# EAGLE design clock (EAGLE 9.0.0)
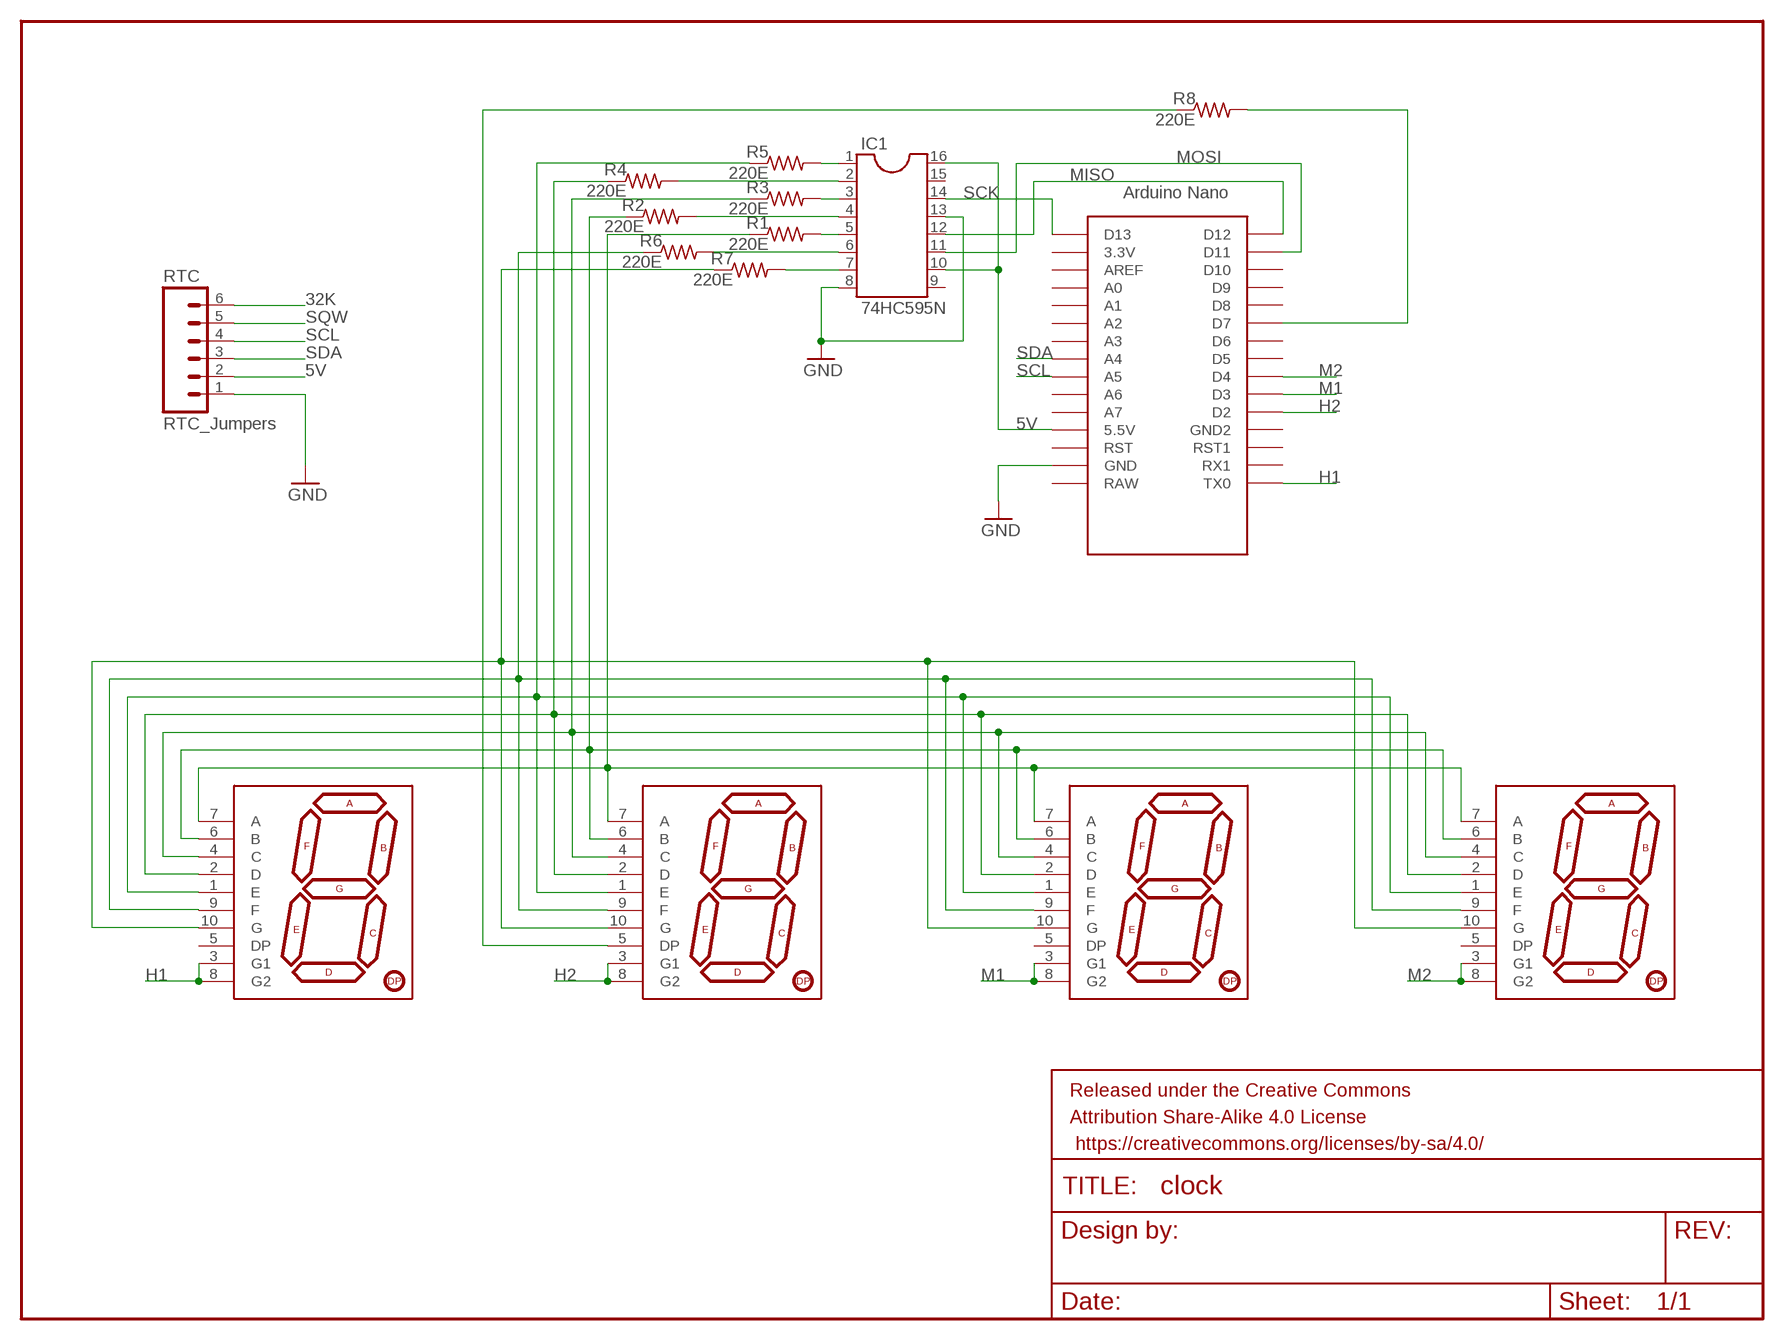
[diagram p0: schematic, sheet 1]

## Parts
FRAME1  FRAME-LETTERNO_PACKAGE  [DUMMY]
IC1  74HC595N  DIL16  [DIL16]
R1  220E  R-US_0309/10  [0309/10]
R2  220E  R-US_0309/10  [0309/10]
R3  220E  R-US_0309/10  [0309/10]
R4  220E  R-US_0309/10  [0309/10]
R5  220E  R-US_0309/10  [0309/10]
R6  220E  R-US_0309/10  [0309/10]
R7  220E  R-US_0309/10  [0309/10]
R8  220E  R-US_0309/10  [0309/10]
RTC  RTC_Jumpers  M06SIP  [1X06]
U$1  7-SEGMENT-1INCH-DIGIT-RED  [7-SEGMENT-1"PTH]
U$2  7-SEGMENT-1INCH-DIGIT-RED  [7-SEGMENT-1"PTH]
U$3  7-SEGMENT-1INCH-DIGIT-RED  [7-SEGMENT-1"PTH]
U$4  7-SEGMENT-1INCH-DIGIT-RED  [7-SEGMENT-1"PTH]
U$5  NANO  [NANO]

## Nets
5V: IC1.10 IC1.16 RTC.2 U$5.5V(5.5V)
32K: RTC.6
A: R1.1 U$1.7(A) U$2.7(A) U$3.7(A) U$4.7(A)
B: R2.1 U$1.6(B) U$2.6(B) U$3.6(B) U$4.6(B)
C: R3.1 U$1.4(C) U$2.4(C) U$3.4(C) U$4.4(C)
D: R4.1 U$1.2(D) U$2.2(D) U$3.2(D) U$4.2(D)
D7: R8.2 U$5.D7
DP: R8.1 U$2.5(DP)
E: R5.1 U$1.1(E) U$2.1(E) U$3.1(E) U$4.1(E)
F: R6.1 U$1.9(F) U$2.9(F) U$3.9(F) U$4.9(F)
G: R7.1 U$1.10(G) U$2.10(G) U$3.10(G) U$4.10(G)
GND: IC1.8 IC1.13 RTC.1 U$5.GND
H1: U$1.3(G1) U$1.8(G2) U$5.TX0
H2: U$2.3(G1) U$2.8(G2) U$5.D2
M1: U$3.3(G1) U$3.8(G2) U$5.D3
M2: U$4.3(G1) U$4.8(G2) U$5.D4
MISO: IC1.12 U$5.D12
MOSI: IC1.11 U$5.D11
Q1: IC1.1 R5.2
Q2: IC1.2 R4.2
Q3: IC1.3 R3.2
Q4: IC1.4 R2.2
Q5: IC1.5 R1.2
Q6: IC1.6 R6.2
Q7: IC1.7 R7.2
SCK: IC1.14 U$5.D13
SCL: RTC.4 U$5.A5
SDA: RTC.3 U$5.A4
SQW: RTC.5
Unconnected: IC1.9 IC1.15 U$1.5(DP) U$3.5(DP) U$4.5(DP) U$5.3.3V U$5.A0 U$5.A1 U$5.A2 U$5.A3 U$5.A6 U$5.A7 U$5.AREF U$5.D5 U$5.D6 U$5.D8 U$5.D9 U$5.D10 U$5.GND1(GND2) U$5.ICSP1 U$5.ICSP2 U$5.ICSP3 U$5.ICSP4 U$5.ICSP5 U$5.ICSP6 U$5.RAW U$5.RST U$5.RST1 U$5.RX1

## Library data of the parts
FRAME1 = SparkFun-Aesthetics:FRAME-LETTER: Schematic Frame - Letter Standard 8.5x11 US Letter frame; DESIGNER: Nobody; VERSION: v01
IC1 = ic-package:DIL16: Dual In Line / Socket
R1-R8 = rcl:R-US_: RESISTOR, American symbol; SPICEPREFIX: R
RTC = SparkFun-Connectors:M06: Header 6 Standard 6-pin 0.1" header. Use with straight break away headers (SKU : PRT-00116), right angle break away headers (PRT-00553), swiss pins (PRT-00743), machine pins (PRT-00117), and female headers (PRT-00115). Molex polarized connector foot print use with SKU : PRT-08094 with associated crimp pins and housings. NOTES ON THE VARIANTS LOCK and LOCK_LONGPADS... This footprint was designed to help hold the alignment of a through-hole component (i.e. 6-pin header) while soldering it into place. You may notice that each hole has been shifted either up or down by 0.005 of an inch from it's more standard position (which is a perfectly straight line). This slight alteration caused the pins (the squares in the middle) to touch the edges of the holes. Because they are alternating, it causes a "brace" to hold the component in place. 0.005 has proven to be the perfect amount of "off-center" position when using our standard breakaway headers. Although looks a little odd when you look at the bare footprint, once you have a header in there, the alteration is very hard to notice. Also, if you push a header all the way into place, it is covered up entirely on the bottom side. This idea of altering the position of holes to aid alignment will be further integrated into the Sparkfun Library for other footprints. It can help hold any component with 3 or more connection pins.
U$1-U$4 = Clock:7-SEGMENT-1INCH-DIGIT: 7-Segment Display, single digit, 1" Digit Height Digit = 25.4mmx13.8mm, Outer Cover = 34mmx23.5mm, Pin Distance(height) = 30.5mm, Pin Distance(Width) = 2.54mm
U$5 = Arduino-clone:NANO: Arduino Nano

## Board
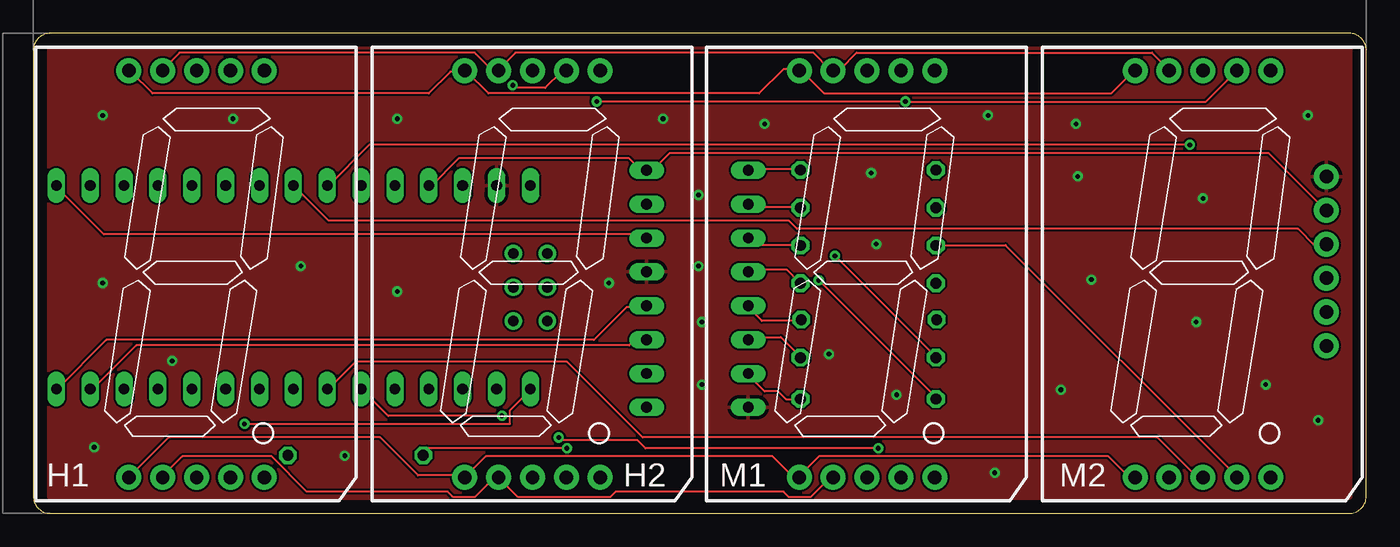
[diagram p1: board, top side]
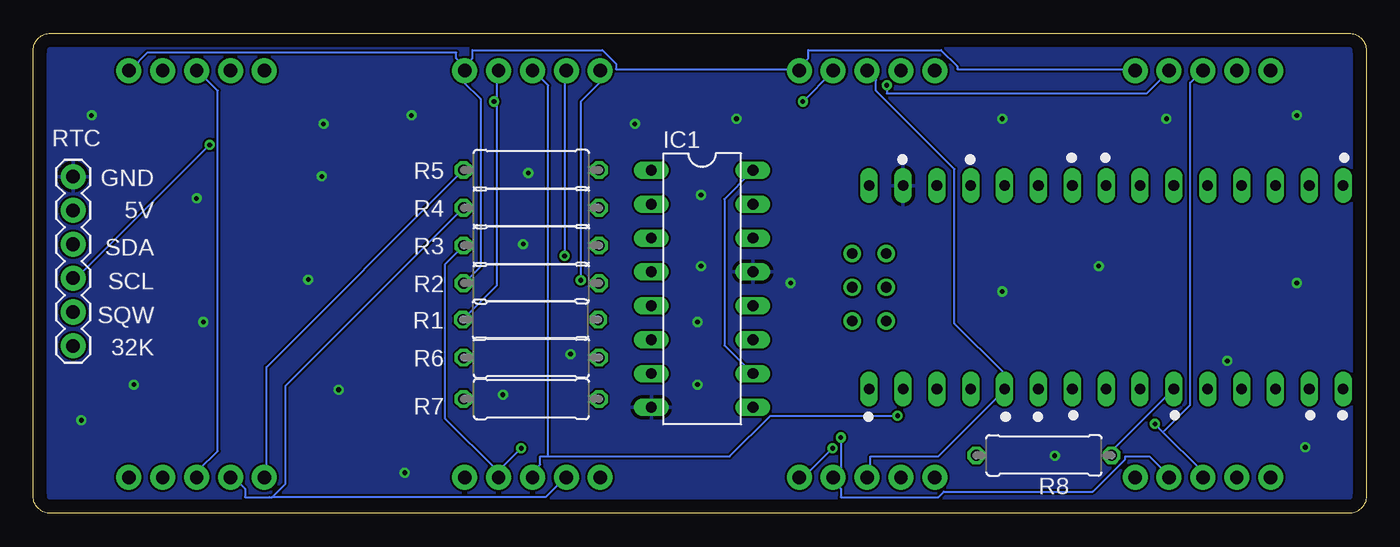
[diagram p2: board, bottom side, seen from below]

Size 100 x 36 mm. Coordinates in mm from the lower left corner, seen from the top.
Outline: 0,34.73 0,1.27 arc90 1.27,0 98.73,0 arc90 100,1.27 100,34.73 arc90 98.73,36 1.27,36 arc90 0,34.73
Copper layers (1*16): Top 0.035mm / dielectric 1.5mm / Bottom 0.035mm
Design rules "default": minimum track width 6mil, minimum drill 0.35mm, track to track 6mil, track to pad 6mil, pad to pad 6mil, via to via 6mil, smd to smd 6mil, copper to edge 40mil, drill to drill 6mil, minimum pad ring 10mil, minimum via ring 8mil, stop-mask expansion 4mil, vias tented up to drill 0mil, thermal gap 10mil

### Footprints (pad centres in the part's own frame; a part is rotated, then mirrored left to right if it is on the bottom)
DIL16 = drill 0.813 long: 1 -8.89,-3.81; 2 -6.35,-3.81; 3 -3.81,-3.81; 4 -1.27,-3.81; 5 1.27,-3.81; 6 3.81,-3.81; 7 6.35,-3.81; 8 8.89,-3.81; 9 8.89,3.81; 10 6.35,3.81; 11 3.81,3.81; 12 1.27,3.81; 13 -1.27,3.81; 14 -3.81,3.81; 15 -6.35,3.81; 16 -8.89,3.81
0309/10 = drill 0.813 octagon: 1 -5.08,0; 2 5.08,0
1X06 = drill 1.016 pad 1.88: 1 0,0; 2 2.54,0; 3 5.08,0; 4 7.62,0; 5 10.16,0; 6 12.7,0
7-SEGMENT-1"PTH = drill 1 pad 1.88: 1 -5.08,-20.5; 2 -2.54,-20.5; 3 0,-20.5; 4 2.54,-20.5; 5 5.08,-20.5; 6 5.08,10; 7 2.54,10; 8 0,10; 9 -2.54,10; 10 -5.08,10
NANO = drill 0.8 long: 3.3V -10.16,24.13; 5V -10.16,-1.27; A0 -10.16,19.05; A1 -10.16,16.51; A2 -10.16,13.97; A3 -10.16,11.43; A4 -10.16,8.89; A5 -10.16,6.35; A6 -10.16,3.81; A7 -10.16,1.27; AREF -10.16,21.59; D2 5.08,1.27; D3 5.08,3.81; D4 5.08,6.35; D5 5.08,8.89; D6 5.08,11.43; D7 5.08,13.97; D8 5.08,16.51; D9 5.08,19.05; D10 5.08,21.59; D11 5.08,24.13; D12 5.08,26.67; D13 -10.16,26.67; GND -10.16,-6.35; GND1 5.08,-1.27; RAW -10.16,-8.89; RST -10.16,-3.81; RST1 5.08,-3.81; RX1 5.08,-6.35; TX0 5.08,-8.89 | drill 0.8: ICSP1 -5.08,-10.16; ICSP2 -5.08,-7.62; ICSP3 -2.54,-10.16; ICSP4 -2.54,-7.62; ICSP5 0,-10.16; ICSP6 0,-7.62

### Placement (x,y rotation side)
FRAME1  -5.33,-6.73 0 top  (outside the outline)
IC1  49.83,16.84 270 bottom
R1  62.7,14.53 0 bottom
R2  62.64,17.26 0 bottom
R3  62.64,20.09 0 bottom
R4  62.64,22.92 0 bottom
R5  62.64,25.75 0 bottom
R6  62.64,11.68 0 bottom
R7  62.64,8.58 0 bottom
R8  24.18,4.35 0 bottom
RTC  97.02,25.26 270 bottom
U$1  12.25,23.2 0 top
U$2  37.45,23.2 0 top
U$3  62.55,23.2 0 top
U$4  87.75,23.2 0 top
U$5  28.4,14.42 270 bottom

### Tracks (layer width: path | path; a pad name or v marks a point on that pad's centre or on a via)
5V
  Top 0.152: U$5.5V 29.87,24.59 31.9,26.62 44.7,26.62 45.52,25.81 45.92,25.81 IC1.16 46.13,25.81 46.53,25.81 47.75,27.03 92.66,27.03 96.93,22.76 RTC.2
  Bottom 0.152: IC1.10 46.13,10.57 48.16,12.6 48.16,23.57 46.13,25.6 IC1.16
A  (via drill 0.35)
  Top 0.152: v35.97,32.11 36.17,31.9 38.41,31.9 39.62,33.12 39.83,33.12 U$2.7 | U$4.7 90.22,33.12 87.99,30.89 v65.43,30.89 v42.27,30.89
  Bottom 0.152: v35.97,32.11 35.97,31.5 16.46,31.5 14.83,33.12 U$1.7 | 65.23,30.89 65.23,33.12 U$3.7 | 65.23,30.89 65.23,17.07 67.67,14.63 R1.1 | 65.23,30.89 v65.43,30.89 | v42.27,30.89 40.03,33.12 U$2.7
B
  Bottom 0.152: U$1.6 17.48,33.33 30.68,33.33 30.68,33.53 31.9,34.75 41.86,34.75 41.86,34.14 42.47,33.53 42.47,33.33 U$2.6 42.67,33.33 56.29,33.33 56.29,33.73 57.3,34.75 67.06,34.75 67.06,34.14 67.67,33.53 | R2.1 67.67,17.27 66.45,18.49 66.45,31.09 67.67,32.31 67.67,33.12 U$3.6 | 67.67,33.53 68.28,34.14 68.28,34.54 91.44,34.54 92.66,33.33 U$4.6 | 67.67,33.53 67.67,33.33 U$3.6 | 67.67,33.53 U$3.6
C  (via drill 0.35)
  Top 0.152: U$4.4 90.22,2.85 72.95,20.12 67.87,20.12 R3.1 | v39.42,5.69 39.62,5.49 45.31,5.49 45.92,4.88 v63.4,4.88
  Bottom 0.152: U$1.4 14.83,2.85 16.26,4.27 18.09,4.27 18.09,4.06 20.52,1.63 31.7,1.63 32.11,1.22 39.42,1.22 39.42,1.83 39.83,2.23 39.83,2.64 U$2.4 39.83,2.85 39.42,3.25 v39.42,5.69 | 65.23,3.05 65.23,2.85 U$3.4 65.23,3.05 | 65.23,3.05 65.23,3.25 69.09,7.11 69.09,18.69 67.87,19.91 R3.1 | 65.23,3.05 v63.4,4.88
D
  Top 0.152: U$1.2 9.75,2.85 11.18,4.27 17.88,4.27 20.52,1.63 31.09,1.63 31.5,1.22 33.12,1.22 34.54,2.64 34.75,2.64 U$2.2 34.95,2.64 36.37,1.22 43.28,1.22 43.69,1.63 56.29,1.63 56.69,1.22 58.32,1.22 59.74,2.64 59.94,2.64 U$3.2
  Bottom 0.152: 82.09,1.22 81.08,2.23 81.08,9.55 67.87,22.76 R4.1 | 82.09,1.22 82.3,1.22 84.12,1.22 84.12,1.83 85.14,2.85 U$4.2 | U$3.2 60.15,2.64 61.57,1.22 82.09,1.22
D7
  Bottom 0.152: U$5.D7 14.63,9.14 18.9,4.88 18.9,4.47 R8.2
DP  (via drill 0.35)
  Top 0.152: v40.03,4.88 29.67,4.88 29.26,4.47 R8.1
  Bottom 0.152: v40.03,4.88 42.06,2.85 42.47,2.85 U$2.5
E
  Top 0.152: U$1.1 7.32,2.85 10.16,5.69 26.01,5.69 28.85,2.85 32.31,2.85 U$2.1 32.51,2.85 33.93,4.27 55.47,4.27 56.9,2.85 57.3,2.85 U$3.1 57.51,2.85 58.93,4.27 80.67,4.27 82.09,2.85 82.5,2.85 U$4.1
  Bottom 0.152: R5.1 67.87,25.6 82.5,10.97 82.5,2.85 U$4.1
F  (via drill 0.35)
  Top 0.152: U$1.9 9.75,33.33 10.97,34.54 33.12,34.54 34.34,33.33 34.75,33.33 U$2.9 34.95,33.33 36.17,34.54 58.52,34.54 59.74,33.33 59.94,33.33 U$3.9 60.15,33.33 60.55,33.33 61.77,34.54 83.92,34.54 85.14,33.33 U$4.9 | v60.15,19.3 67.67,11.79 R6.1
  Bottom 0.152: v60.15,19.3 60.15,33.12 U$3.9
G  (via drill 0.35)
  Top 0.152: U$1.10 7.32,33.12 8.94,31.5 29.67,31.5 31.29,33.12 32.31,33.12 U$2.10 32.51,33.12 34.14,31.5 54.46,31.5 56.29,33.33 57.3,33.33 U$3.10 57.51,33.12 57.71,33.12 59.33,31.5 80.87,31.5 82.5,33.12 U$4.10 | v58.93,17.48 67.67,8.74 R7.1
  Bottom 0.152: v58.93,17.48 58.93,30.89 57.51,32.31 57.51,33.12 U$3.10
GND  (via drill 0.35)
  other vias: 5.21,29.84 14.99,29.59 27.3,29.59 27.3,16.64 20.07,18.54 5.21,17.27 4.57,4.95 43.18,17.27 49.91,23.88 49.91,18.54 50.16,14.35 50.16,9.65 78.36,25.27 71.63,29.84 54.86,29.21 79.38,17.53 92.46,9.65 95.63,29.84 96.39,6.99 23.37,4.32 87.25,14.35 87.76,23.62 77.09,9.27 72.14,3.05 78.23,29.21 10.41,11.43 47.24,29.59 62.87,25.53 63.25,20.19 59.69,11.94 64.77,8.89
  pour Bottom: -0.25,36.83 100.33,36.83 100.33,-1.27 -0.25,-1.27
  pour Top: -0.25,36.83 100.33,36.83 100.33,-1.27 -0.25,-1.27
H1  (via drill 0.35)
  Top 0.152: v15.85,6.71 35.76,6.71 35.76,7.72 37.19,9.14 U$5.TX0
  Bottom 0.152: 15.24,6.1 12.39,3.25 12.39,2.85 U$1.3 | 15.24,6.1 v15.85,6.71 | 15.24,6.1 13.21,8.13 13.21,32.31 12.39,33.12 U$1.8
H2
  Bottom 0.152: U$2.3 37.39,2.85 37.19,3.05 37.19,4.27 32.11,4.27 27.23,9.14 U$5.D2 27.23,9.35 27.23,10.57 30.89,14.22 30.89,25.81 36.78,31.7 36.78,32.51 37.39,33.12 U$2.8
M1  (via drill 0.35)
  Top 0.152: v35.15,7.32 26.62,7.32 24.79,9.14 U$5.D3
  Bottom 0.152: v35.15,7.32 44.7,7.32 47.75,4.27 61.37,4.27 | 61.37,4.27 61.98,4.27 61.98,3.66 62.38,3.25 62.38,2.85 U$3.3 | 61.37,4.27 61.37,32.11 62.38,33.12 U$3.8
M2
  Top 0.152: U$5.D4 22.15,9.35 24.18,11.38 40.03,11.38 45.72,5.69 84.33,5.69 87.17,2.85 87.58,2.85 U$4.3
  Bottom 0.152: U$4.8 87.58,33.12 86.16,31.7 86.16,4.67 87.58,3.25 87.58,2.85 U$4.3
MISO
  Top 0.152: U$5.D12 1.83,9.35 5.49,13.01 42.06,13.01 44.5,15.44 45.92,15.44 IC1.12
MOSI
  Top 0.152: U$5.D11 4.47,9.35 7.72,12.6 44.7,12.6 45.11,13.01 45.92,13.01 IC1.11
Q1
  Top 0.152: IC1.1 53.65,25.81 57.51,25.81 R5.2
Q2
  Top 0.152: IC1.2 53.65,23.16 53.85,22.96 57.51,22.96 R4.2
Q3
  Top 0.152: IC1.3 53.65,20.52 54.05,20.12 57.51,20.12 R3.2
Q4
  Top 0.152: R2.2 57.51,17.27 56.49,18.29 53.65,18.29 IC1.4
Q5
  Top 0.152: IC1.5 53.65,15.44 54.66,14.43 57.51,14.43 R1.2
Q6
  Top 0.152: R6.2 57.51,11.79 56.08,13.21 53.65,13.21 IC1.6
Q7
  Top 0.152: IC1.7 53.65,10.36 54.86,9.14 55.88,9.14 56.49,8.53 57.51,8.53 R7.2
SCK
  Top 0.152: U$5.D13 1.83,24.38 5.28,20.93 45.72,20.93 45.92,20.73 IC1.14
SCL  (via drill 0.35)
  Top 0.152: v86.77,27.64 25.2,27.64 22.15,24.59 U$5.A5
  Bottom 0.152: v86.77,27.64 96.93,17.48 RTC.4
SDA
  Top 0.152: U$5.A4 19.71,24.38 22.15,21.95 56.69,21.95 57.3,21.34 94.89,21.34 96.11,20.12 96.93,20.12 RTC.3

### Text on the board
tPlace: H1 | H2 | M1 | M2
bPlace: GND | 5V | SDA | SCL | SQW | 32K